# EAGLE design Telecoding-Shield (EAGLE 7.6.0)
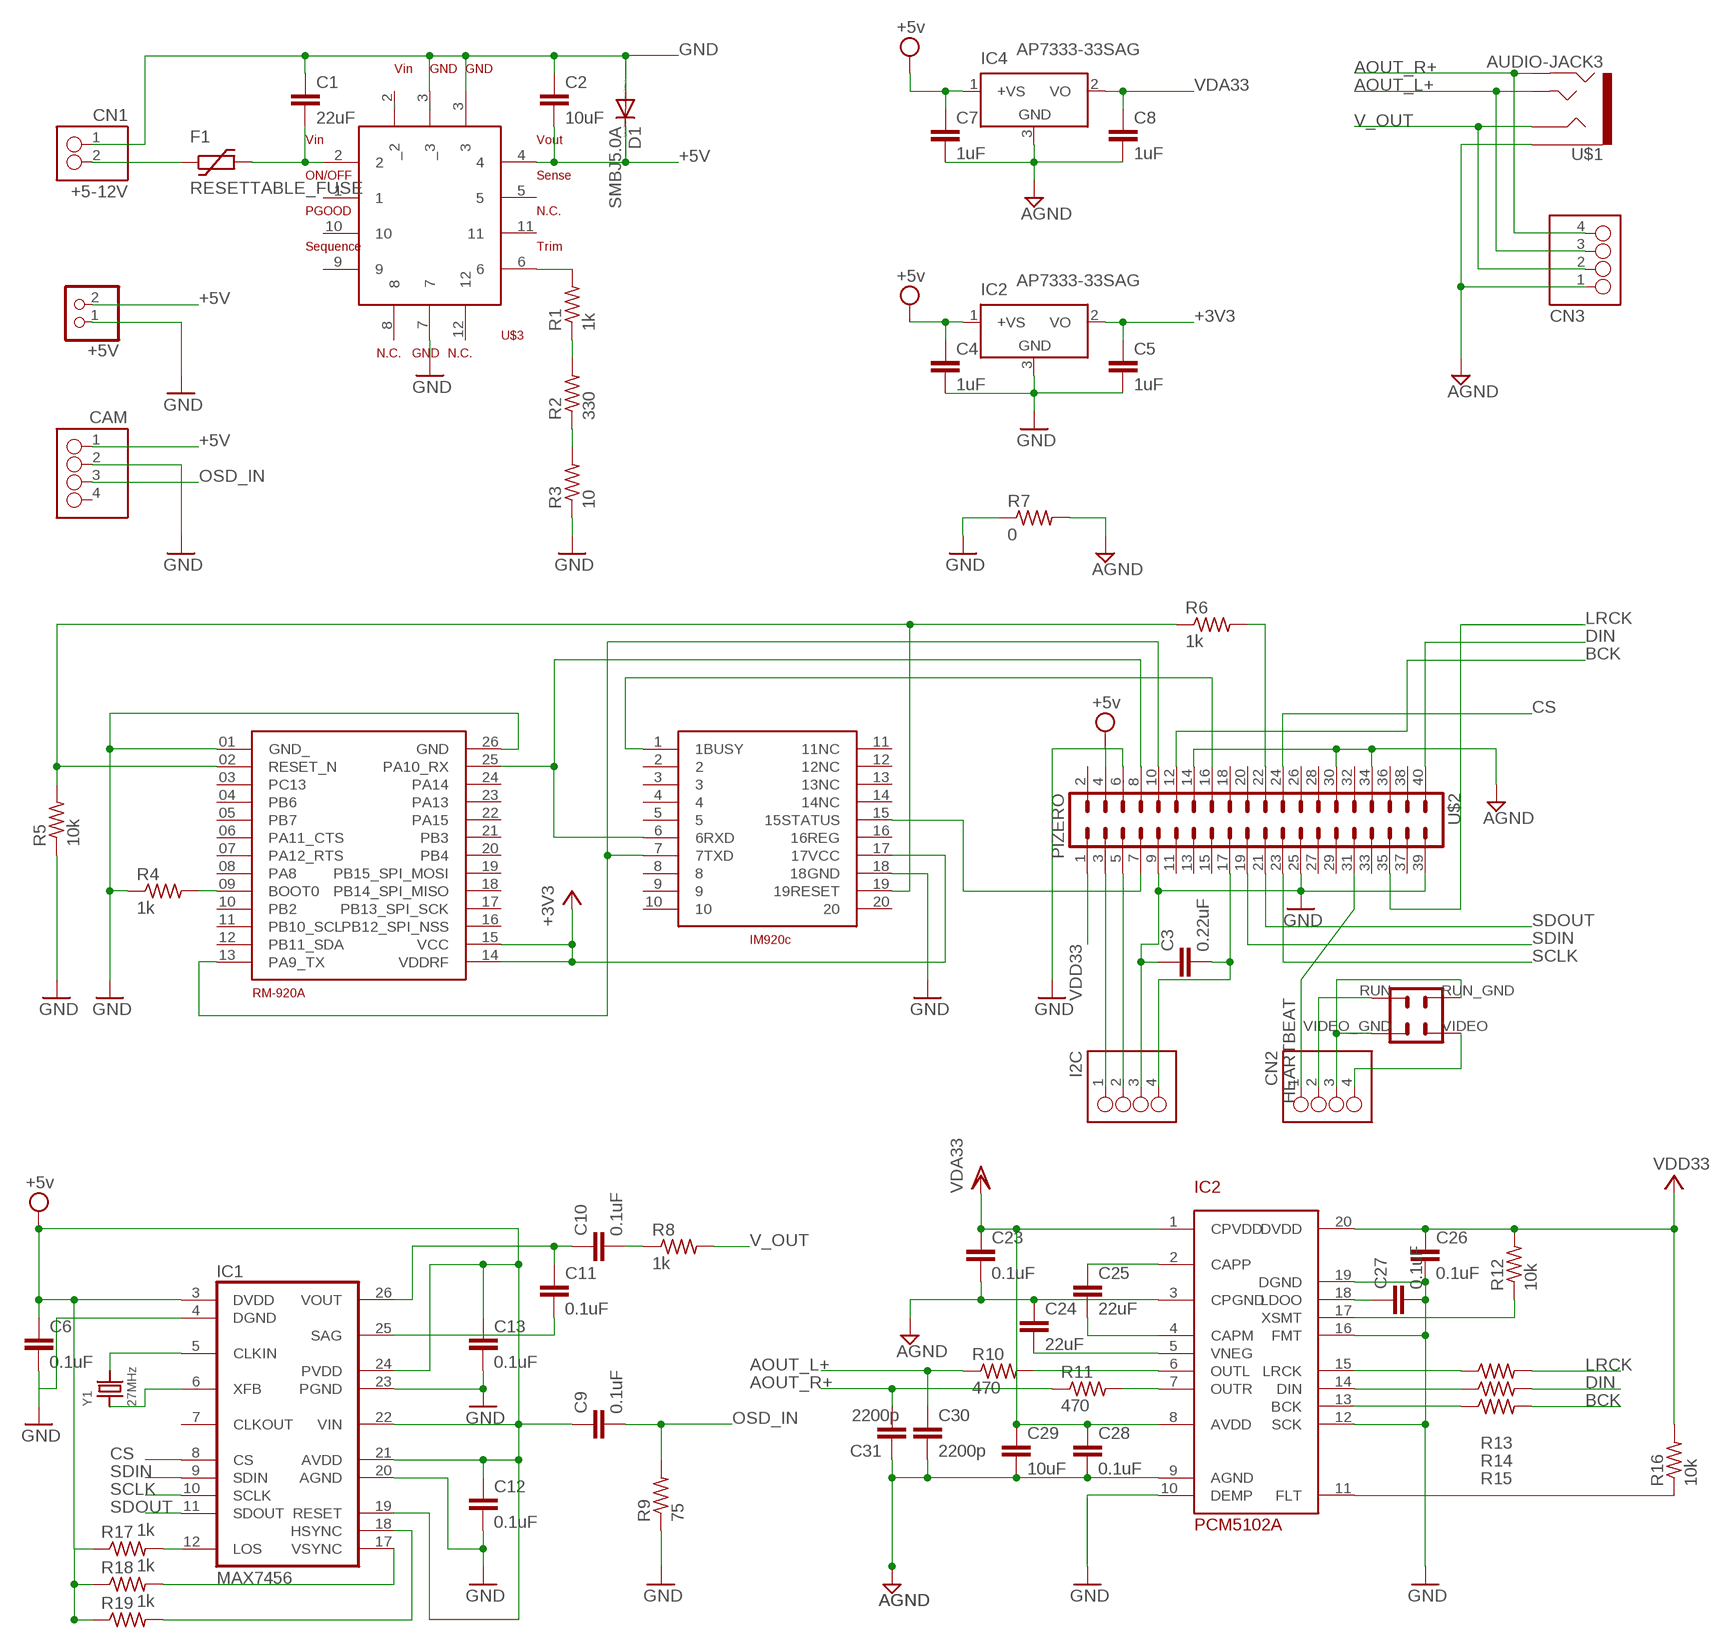
[diagram p0: schematic, sheet 1]

## Parts
+5V  PINHD-1X2  [1X02]
C1  22uF  10UF-0805-10V-10%  [0805]
C2  10uF  10UF-0805-10V-10%  [0805]
C3  0.22uF  10UF-0805-10V-10%  [0805]
C4  1uF  10UF-0805-10V-10%  [0805]
C5  1uF  10UF-0805-10V-10%  [0805]
C6  0.1uF  10UF-0805-10V-10%  [0805]
C7  1uF  10UF-0805-10V-10%  [0805]
C8  1uF  10UF-0805-10V-10%  [0805]
C9  0.1uF  10UF-0805-10V-10%  [0805]
C10  0.1uF  10UF-0805-10V-10%  [0805]
C11  0.1uF  10UF-0805-10V-10%  [0805]
C12  0.1uF  10UF-0805-10V-10%  [0805]
C13  0.1uF  10UF-0805-10V-10%  [0805]
C23  0.1uF  10UF-0805-10V-10%  [0805]
C24  22uF  10UF-0805-10V-10%  [0805]
C25  22uF  10UF-0805-10V-10%  [0805]
C26  0.1uF  10UF-0805-10V-10%  [0805]
C27  0.1uF  10UF-0805-10V-10%  [0805]
C28  0.1uF  10UF-0805-10V-10%  [0805]
C29  10uF  10UF-0805-10V-10%  [0805]
C30  2200p  10UF-0805-10V-10%  [0805]
C31  2200p  10UF-0805-10V-10%  [0805]
CAM  SM04B-SRSS-TB  [SM04B-SRSS-TB]
CN1  +5-12V  SM02B-SRSS-TB  [SM02B-SRSS-TB]
CN2  SM04B-SRSS-TB  [SM04B-SRSS-TB]
CN3  SM04B-SRSS-TB  [SM04B-SRSS-TB]
D1  SMBJ5.0A  S1M  [SMA]
F1  RESETTABLE_FUSE  1812L  [1812L]
I2C  SM04B-SRSS-TB  [SM04B-SRSS-TB]
IC1  MAX7456  [TSSOP28]
IC2  AP7333-33SAG  LM50  [SOT23]
IC3  PCM5102  [TSSOP20]
IC4  AP7333-33SAG  LM50  [SOT23]
R1  1k  R-US_M0805  [M0805]
R2  330  R-US_M0805  [M0805]
R3  10  R-US_M0805  [M0805]
R4  1k  R-US_M0805  [M0805]
R5  10k  R-US_M0805  [M0805]
R6  1k  R-US_M0805  [M0805]
R7  0  R-US_M0805  [M0805]
R8  1k  R-US_M0805  [M0805]
R9  75  R-US_M0805  [M0805]
R10  470  R-US_M0805  [M0805]
R11  470  R-US_M0805  [M0805]
R12  10k  R-US_M0805  [M0805]
R13  27  R-US_M0805  [M0805]
R14  27  R-US_M0805  [M0805]
R15  27  R-US_M0805  [M0805]
R16  10k  R-US_M0805  [M0805]
R17  1k  R-US_M0805  [M0805]
R18  1k  R-US_M0805  [M0805]
R19  1k  R-US_M0805  [M0805]
RM-920A  RM-92A_SOCKETBP  [RM-92A]
U$1  AUDIO-JACK3  [AUDIO-JACK-TRRS-SMD]
U$2  PIZERO  PIZERO_THROUGH_HOLE  [PIZERO_THOUGH_HOLE]
U$3  MURATA_OKL_T6_W12  [MURATA_OKL_T6_W12]
U$7  IM920C  [IM920C]
Y1  27MHz  CRYSTAL.ABS07  [ABS07]

## Nets
+3V3: C5.1 IC2.2(VO) RM-920A.14(VDDRF) RM-920A.15(VCC) U$7.17(17VCC)
+5V: +5V.2 C2.2 C4.1 C6.1 C7.1 C9.1 C12.1 C13.1 CAM.1 D1.C IC1.3(DVDD) IC1.19(RESET) IC1.21(AVDD) IC1.22(VIN) IC1.24(PVDD) IC2.1(+VS) IC4.1(+VS) R17.1 R18.1 R19.1 U$2.4 U$3.4 ; supply symbol labelled +5v
AGND: C7.2 C8.2 C23.2 C24.1 C28.2 C29.2 C30.2 C31.1 CN3.1 IC3.3(CPGND) IC3.9(AGND) IC4.3(GND) R7.2 U$1.EARTH U$2.14 U$2.30 U$2.34 U$3.7 ; supply symbol labelled GND
AOUT_L+: C30.1 CN3.3 R10.1 U$1.TIP
AOUT_R+: C31.2 CN3.4 R11.1 U$1.RING2
BCK: R15.2 U$2.12
CS: IC1.8(CS) U$2.24
DIN: R14.2 U$2.40
GND: +5V.1 C1.1 C2.1 C3.1 C4.2 C5.2 C6.2 C12.2 C13.2 C26.2 C27.2 CAM.2 CN1.1 CN2.3 D1.A I2C.3 IC1.4(DGND) IC1.20(AGND) IC1.23(PGND) IC2.3(GND) IC3.10(DEMP) IC3.12(SCK) IC3.16(FMT) IC3.19(DGND) R3.1 R4.1 R5.1 R7.1 R9.1 RM-920A.01(GND_) RM-920A.26(GND) U$2.6 U$2.9 U$2.25 U$2.39 U$2.RUN_GND U$2.VIDEO_GND(VIDEOP_GND) U$3.3 U$3._3 U$7.18(18GND)
HEARTBEAT: CN2.1 U$2.31
LRCK: R13.2 U$2.35
N$1: R5.2 R6.1 RM-920A.02(RESET_N) U$7.19(19RESET)
N$3: C1.2 F1.2 U$3.2
N$4: R6.2 U$2.22
N$5: RM-920A.25(PA10_RX) U$2.8 U$7.6(6RXD)
N$6: R4.2 RM-920A.09(BOOT0)
N$7: R2.1 R3.2
N$8: U$2.7 U$7.15(15STATUS)
N$9: U$2.16 U$7.1(1BUSY)
N$10: R1.1 R2.2
N$11: R1.2 U$3.6
N$12: CN2.4 U$2.VIDEO
N$13: IC1.5(CLKIN) Y1.2
N$14: RM-920A.13(PA9_TX) U$2.10 U$7.7(7TXD)
N$15: CN1.2 F1.1
N$16: IC1.6(XFB) Y1.1
N$17: IC1.12(LOS) R17.2
N$18: IC1.17(VSYNC) R18.2
N$19: IC1.18(HSYNC) R19.2
N$22: I2C.1 U$2.3
N$25: I2C.2 U$2.5
N$27: C3.2 I2C.4 U$2.17
N$29: CN2.2 U$2.RUN
N$33: C10.1 C11.1 IC1.26(VOUT)
N$34: C10.2 R8.1
N$35: C11.2 IC1.25(SAG)
N$41: C24.2 IC3.5(VNEG)
N$42: C25.1 IC3.2(CAPP)
N$43: C25.2 IC3.4(CAPM)
N$44: C27.1 IC3.18(LDOO)
N$45: IC3.7(OUTR) R11.2
N$46: IC3.15(LRCK) R13.1
N$47: IC3.6(OUTL) R10.2
N$49: IC3.14(DIN) R14.1
N$50: IC3.13(BCK) R15.1
N$51: IC3.11(FLT) R16.1
N$52: IC3.17(XSMT) R12.1
OSD_IN: C9.2 CAM.3 R9.2
SCLK: IC1.10(SCLK) U$2.23
SDIN: IC1.9(SDIN) U$2.19
SDOUT: IC1.11(SDOUT) U$2.21
V_OUT: CN3.2 R8.2 U$1.RING1
VDA33: C8.1 C23.1 C28.1 C29.1 IC3.1(CPVDD) IC3.8(AVDD) IC4.2(VO)
VDD33: C26.1 IC3.20(DVDD) R12.2 R16.2 U$2.1
Unconnected: CAM.4 IC1.7(CLKOUT) RM-920A.03(PC13) RM-920A.04(PB6) RM-920A.05(PB7) RM-920A.06(PA11_CTS) RM-920A.07(PA12_RTS) RM-920A.08(PA8) RM-920A.10(PB2) RM-920A.11(PB10_SCL) RM-920A.12(PB11_SDA) RM-920A.16(PB12_SPI_NSS) RM-920A.17(PB13_SPI_SCK) RM-920A.18(PB14_SPI_MISO) RM-920A.19(PB15_SPI_MOSI) RM-920A.20(PB4) RM-920A.21(PB3) RM-920A.22(PA15) RM-920A.23(PA13) RM-920A.24(PA14) U$2.2 U$2.11 U$2.13 U$2.15 U$2.18 U$2.20 U$2.26 U$2.27 U$2.28 U$2.29 U$2.32 U$2.33 U$2.36 U$2.37 U$2.38 U$3.1 U$3.5 U$3.8 U$3.9 U$3.10 U$3.11 U$3.12 U$3._2 U$7.2 U$7.3 U$7.4 U$7.5 U$7.8 U$7.9 U$7.10 U$7.11(11NC) U$7.12(12NC) U$7.13(13NC) U$7.14(14NC) U$7.16(16REG) U$7.20

## Library data of the parts
+5V = pinhead:PINHD-1X2: PIN HEADER
C1 C3-C13 C23-C28 C30 C31 = SparkFun-Capacitors:10UF: 10.0µF ceramic capacitors A capacitor is a passive two-terminal electrical component used to store electrical energy temporarily in an electric field.; PROD_ID: CAP-11330; VALUE: 10uF
C2 C29 = SparkFun-Capacitors:10UF: 10.0µF ceramic capacitors A capacitor is a passive two-terminal electrical component used to store electrical energy temporarily in an electric field.; PROD_ID: CAP-11330
CAM CN2 CN3 I2C = con-jst-sh:SM04B-SRSS-TB
CN1 = con-jst-sh:SM02B-SRSS-TB
D1 = diode:S1M
F1 = ptc-littlefuse:1812L: FUSE
IC1 = max7456:MAX7456
IC2 IC4 = linear:LM50: SOT-23 Single-Supply Centigrade Temperature Sensor Vout = (10mV/°C x Temp °C) +5mmmV Source: http://cache.national.com/ds/LM/LM50.pdf
IC3 = PCM5102:PCM5102
R1-R19 = resistor:R-US_: RESISTOR, American symbol
RM-920A = RM-92A:RM-92A_SOCKET: RM-92A Connector 13pin × 2 (1.27pitch)
U$1 = SparkFun-Connectors:AUDIO-JACK3: Audio jack - 3.5mm TRRS variety - two rings.; PROD_ID: CONN-10676
U$2 = pizero_video:PIZERO_THROUGH_HOLE: raspberry pi zero with RUN & VIDEO PIN
U$3 = murata-DCDC:MURATA_OKL_T6_W12: Murata DC-DC Converter OKL_T6_W12 OUTPUT:5V 3A
U$7 = IM920c:IM920C: interplan IM920c
Y1 = abracon:CRYSTAL

## Board
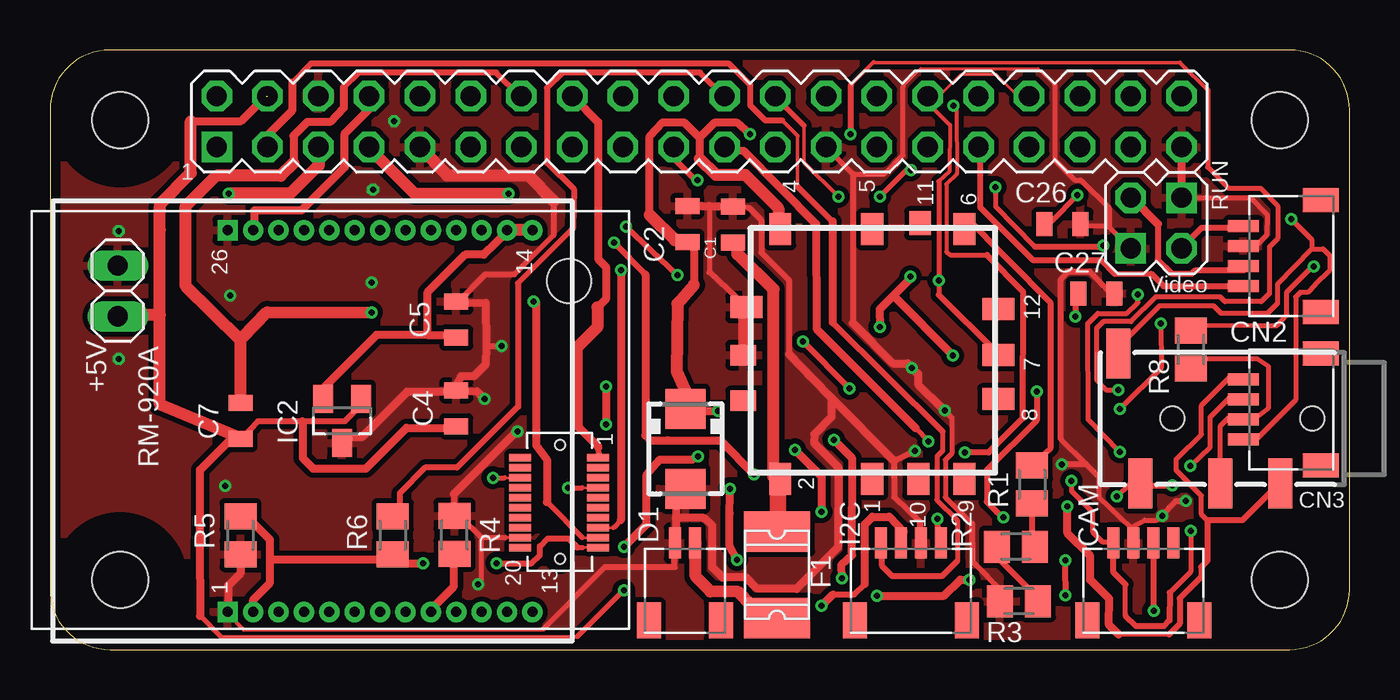
[diagram p1: board, top side]
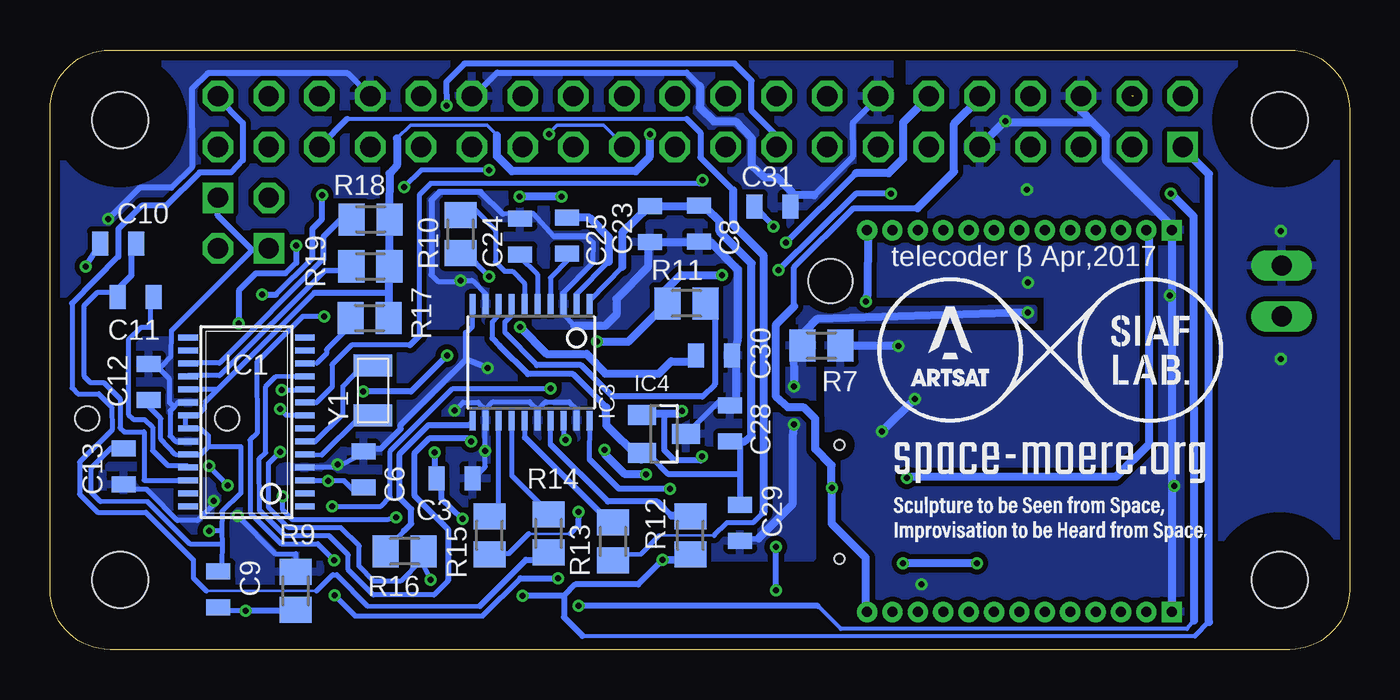
[diagram p2: board, bottom side, seen from below]

Size 65 x 30 mm. Coordinates in mm from the lower left corner, seen from the top.
Copper layers (1*16): Top 0.035mm / dielectric 1.53mm / Bottom 0.035mm
Design rules "pban_5mil-l2 *": minimum track width 5mil, minimum drill 0.3mm, track to track 5mil, track to pad 0.229mm, pad to pad 5mil, via to via 5mil, smd to smd 5mil, copper to edge 0.5mm, drill to drill 0.5mm, minimum pad ring 0.15mm, minimum via ring 0.15mm, stop-mask expansion 0.05mm, vias tented up to drill 0.35mm, thermal gap 10mil

### Footprints (pad centres in the part's own frame; a part is rotated, then mirrored left to right if it is on the bottom)
1X02 = drill 1.016 long: 1 -1.27,0; 2 1.27,0
0805 = smd 0.8 x 1.2: 1 -0.9,0; 2 0.9,0
SM04B-SRSS-TB = smd 0.6 x 1.55: 1 -1.5,3.04; 2 -0.5,3.04; 3 0.5,3.04; 4 1.5,3.04 | smd 1.2 x 1.8: P-MOUNT1 -2.8,-0.835; P-MOUNT2 2.8,-0.835
SM02B-SRSS-TB = smd 0.6 x 1.55: 1 -0.5,3.04; 2 0.5,3.04 | smd 1.2 x 1.8: P-MOUNT1 -1.8,-0.835; P-MOUNT2 1.8,-0.835
SMA = smd 2 x 2: A 2,0; C -2,0
1812L = smd 2.03 x 3.3: 1 -2.16,0; 2 2.16,0
TSSOP28 = smd 0.305 x 0.991: 1 -4.225,-2.918; 2 -3.575,-2.918; 3 -2.925,-2.918; 4 -2.275,-2.918; 5 -1.625,-2.918; 6 -0.975,-2.918; 7 -0.325,-2.918; 8 0.325,-2.918; 9 0.975,-2.918; 10 1.625,-2.918; 11 2.275,-2.918; 12 2.925,-2.918; 13 3.575,-2.918; 14 4.225,-2.918; 15 4.225,2.918; 16 3.575,2.918; 17 2.925,2.918; 18 2.275,2.918; 19 1.625,2.918; 20 0.975,2.918; 21 0.325,2.918; 22 -0.325,2.918; 23 -0.975,2.918; 24 -1.625,2.918; 25 -2.275,2.918; 26 -2.925,2.918; 27 -3.575,2.918; 28 -4.225,2.918
SOT23 = smd 1 x 1.4: 1 -0.95,-1.1; 2 0.95,-1.1; 3 0,1.1
TSSOP20 = smd 0.305 x 0.991: 1 -2.925,-2.918; 2 -2.275,-2.918; 3 -1.625,-2.918; 4 -0.975,-2.918; 5 -0.325,-2.918; 6 0.325,-2.918; 7 0.975,-2.918; 8 1.625,-2.918; 9 2.275,-2.918; 10 2.925,-2.918; 11 2.925,2.918; 12 2.275,2.918; 13 1.625,2.918; 14 0.975,2.918; 15 0.325,2.918; 16 -0.325,2.918; 17 -0.975,2.918; 18 -1.625,2.918; 19 -2.275,2.918; 20 -2.925,2.918
M0805 = smd 1.3 x 1.6: 1 -0.95,0; 2 0.95,0
RM-92A = drill 0.5 pad 1.016 square: 01 -9.55,8.89; 26 9.55,8.89 | drill 0.5 pad 1.016: 02 -9.55,7.62; 03 -9.55,6.35; 04 -9.55,5.08; 05 -9.55,3.81; 06 -9.55,2.54; 07 -9.55,1.27; 08 -9.55,0; 09 -9.55,-1.27; 10 -9.55,-2.54; 11 -9.55,-3.81; 12 -9.55,-5.08; 13 -9.55,-6.35; 14 9.55,-6.35; 15 9.55,-5.08; 16 9.55,-3.81; 17 9.55,-2.54; 18 9.55,-1.27; 19 9.55,0; 20 9.55,1.27; 21 9.55,2.54; 22 9.55,3.81; 23 9.55,5.08; 24 9.55,6.35; 25 9.55,7.62
AUDIO-JACK-TRRS-SMD = smd 1.2 x 2.5: EARTH 11.3,-3.25; RING1 6.2,3.25; RING2 3.2,3.25; TIP 10.2,3.25 | hole 1.2: 1.6,0; 8.6,0
PIZERO_THOUGH_HOLE = drill 1.016 square: 1 8.34,25.15; RUN_GND 56.6,22.61; VIDEO_GND 54.06,20.07 | drill 1.016 octagon: 2 8.34,27.69; 3 10.88,25.15; 4 10.88,27.69; 5 13.42,25.15; 6 13.42,27.69; 7 15.96,25.15; 8 15.96,27.69; 9 18.5,25.15; 10 18.5,27.69; 11 21.04,25.15; 12 21.04,27.69; 13 23.58,25.15; 14 23.58,27.69; 15 26.12,25.15; 16 26.12,27.69; 17 28.66,25.15; 18 28.66,27.69; 19 31.2,25.15; 20 31.2,27.69; 21 33.74,25.15; 22 33.74,27.69; 23 36.28,25.15; 24 36.28,27.69; 25 38.82,25.15; 26 38.82,27.69; 27 41.36,25.15; 28 41.36,27.69; 29 43.9,25.15; 30 43.9,27.69; 31 46.44,25.15; 32 46.44,27.69; 33 48.98,25.15; 34 48.98,27.69; 35 51.52,25.15; 36 51.52,27.69; 37 54.06,25.15; 38 54.06,27.69; 39 56.6,25.15; 40 56.6,27.69; RUN 54.06,22.61; VIDEO 56.6,20.07 | hole 2.8: 3.5,3.5; 3.5,26.5; 61.5,26.5; 61.5,3.5
MURATA_OKL_T6_W12 = smd 1.6 x 1.1: 1 -5.44,0.15; 2 -5.44,4.75; 4 7.06,4.75; 5 7.06,0.15; 6 7.06,-4.45; 9 -5.44,-4.45; 10 -5.44,-2.15 | smd 1.1 x 1.6: 3 3.16,6.45; 7 0.76,-6.15; 8 -1.44,-6.15; 12 3.06,-6.15 | smd 1.2 x 1.1: 11 7.36,-2.25 | smd 1.016 x 1.27: _2 -1.524,6.604; _3 0.762,6.604
IM920C = smd 0.36 x 1.1: 1 -1.825,-13.45; 2 -1.825,-9.55; 3 -2.325,-13.45; 4 -2.325,-9.55; 5 -2.825,-13.45; 6 -2.825,-9.55; 7 -3.325,-13.45; 8 -3.325,-9.55; 9 -3.825,-13.45; 10 -3.825,-9.55; 11 -4.325,-13.45; 12 -4.325,-9.55; 13 -4.825,-13.45; 14 -4.825,-9.55; 15 -5.325,-13.45; 16 -5.325,-9.55; 17 -5.825,-13.45; 18 -5.825,-9.55; 19 -6.325,-13.45; 20 -6.325,-9.55 | hole 2.2: 7,-12 | hole 0.5: -6.9,-11.55; -1.2,-11.55
ABS07 = smd 1.1 x 1.9: 1 -1.25,0; 2 1.25,0

### Placement (x,y rotation side)
+5V  3.39,17.94 270 top
C1  34.16,21.27 270 top
C2  31.88,21.29 270 top
C3  44.77,8.57 180 bottom
C4  20.32,12.06 90 top
C5  20.32,16.51 90 top
C6  49.32,9 90 bottom
C7  9.53,11.43 90 top
C8  32.53,21.32 270 bottom
C9  56.58,3.02 270 bottom
C10  61.59,20.32 180 bottom
C11  60.72,17.64 0 bottom
C12  60.06,13.39 90 bottom
C13  61.32,9.16 270 bottom
C23  34.98,21.28 270 bottom
C24  41.48,20.67 270 bottom
C25  39.14,20.7 270 bottom
C26  50.64,21.28 0 top
C27  52.34,17.8 0 top
C28  30.98,11.3 90 bottom
C29  30.48,6.35 270 bottom
C30  31.78,14.71 0 bottom
C31  28.86,22.17 180 bottom
CAM  54.7,2.29 0 top
CN1  31.75,2.29 0 top
CN2  62.74,19.68 90 top
CN3  62.74,12.02 90 top
D1  31.77,10.05 270 top
F1  36.36,3.74 90 top
I2C  43.05,2.29 0 top
IC1  55.17,11.38 90 bottom
IC2  14.61,11.44 180 top
IC3  40.94,14.37 180 bottom
IC4  34.29,10.79 270 bottom
R1  49.12,8.26 90 top
R2  48.32,5.15 0 top
R3  48.47,2.42 0 top
R4  20.23,5.74 270 top
R5  9.53,5.71 90 top
R6  17.14,5.71 90 top
R7  26.4,15.21 180 bottom
R8  57.07,15.02 270 top
R9  52.7,2.94 270 bottom
R10  44.47,20.79 90 bottom
R11  33.17,17.32 0 bottom
R12  32.97,5.71 270 bottom
R13  36.83,5.42 270 bottom
R14  40.05,5.8 270 bottom
R15  43.02,5.71 270 bottom
R16  47.27,4.92 0 bottom
R17  49.01,16.59 180 bottom
R18  48.96,21.52 180 bottom
R19  48.98,19.18 180 bottom
RM-920A  17.78,11.43 90 top
U$1  64.75,11.55 180 top
U$2  0,0 0 top
U$3  41.27,13.97 90 top
U$7  13.97,11.43 90 top
Y1  48.85,12.96 270 bottom

### Tracks (layer width: path | path; a pad name or v marks a point on that pad's centre or on a via)
+3V3  (via drill 0.3)
  Top 0.127: 26.62,5.6 27.44,5.6 U$7.17
  Top 0.254: 19.69,15.74 20.3,15.7 C5.1 | 22.85,20.9 RM-920A.15 22.9,21 | 13.69,13.1 13.7,12.6 IC2.2 | 24.85,7.38 26.62,5.6 | 24.1,21 RM-920A.14
  Top 0.406: 18.86,15.75 19.69,15.74 | 18.86,15.75 18.86,17.86 20.76,19.76 21.69,19.76 22.85,20.9 | 13.69,13.1 16.33,15.75 18.86,15.75 | v24.19,17.41 24.31,17.36 24.31,10.24 24.85,9.51 24.85,7.38
  Top 0.61: 24.1,21 22.9,21
  Bottom 0.127: 24.1,20.98 RM-920A.14
  Bottom 0.406: v24.19,17.41 24.21,17.49 24.11,17.76 24.1,20.98
+5V  (via drill 0.3)  (1 unrouted)
  Top 0.127: 32.09,20.3 C2.2 | 32.1,20.5 31.25,20.48 | 9,26.5 9.56,26.44 | 5.5,21 5.49,21
  Top 0.2: 8.53,0.65 26.38,0.66
  Top 0.254: v51.09,8.45 51.09,7.94 52.14,6.89 52.14,5.9 52.62,5.4 53.1,5.4 CAM.1 53.2,5.3 | 53.79,1.7 53.79,3.26 | 56,2.85 57.05,3.9 v57.05,5.95 | 15.5,12.5 15.53,12.5 15.6,12.6 IC2.1 | 9.6,10.6 C7.1 | 9.5,10.6 C7.1 | 32.42,9.66 v32.4,9.66 | v28.7,2.96 28.75,3.04 26.38,0.66 | 7.51,1.68 8.53,0.65 | 31.76,12.1 D1.C | 31.77,12.92 D1.C | 20.3,11.25 C4.1 20.3,11.1 | 32.51,25.64 32.49,25.6 | U$3.4 36.5,21.1 36.42,21.1 | 32.1,20.5 C2.2 | D1.C 31.8,12 31.9,11.93 | 9,10.5 C7.1
  Top 0.305: 53.2,5.3 53.2,3.85 53.79,3.26 | 53.79,1.7 54.33,1.18 55.71,1.18 55.99,1.46 56,2.85 | 15.53,12.5 15.22,12.2 15.22,11.91 14.75,11.44 12.63,11.44 10.4,11.44 9.6,10.6 | 32.12,9.51 32.42,9.66
  Top 0.406: 31.9,11.93 v33.4,11.93 | 7.04,26.44 9.56,26.44 10.8,27.68 | 32.12,9.51 30.5,9.51 29.84,8.75 29.84,6.26 v28.7,5.14 | 7.51,1.68 7.5,5.36 7.5,5.5 7.5,9 9,10.5 | 32.2,20.3 32.2,18.24 | 32.49,24.56 32.49,25.6 31.7,26.39 30.66,26.39 29.99,25.68 29.99,21.75 | 32.51,25.64 33.23,26.35 34.36,26.35 v35,25.8 | 20.3,11.1 17.83,11.1 15.8,9.06 13.16,9.06 12.64,9.58 12.63,11.44 | 3.5,16.75 +5V.2
  Top 0.61: 7.04,26.44 7.04,23.84 5.51,22.29 5.49,22.01 5.49,21 5.49,16.75 | 5.49,16.75 5.49,12.28 9.5,10.6 | 32.09,20.3 32.2,20.3 | 32.2,18.24 31.38,17.3 31.34,13.91 31.77,12.92 | 36.42,21.06 36.42,21.1 36.42,22.09 34.76,23.76 33.3,23.76 32.49,24.56 | 31.25,20.48 29.99,21.75 | 5.49,16.75 3.5,16.75
  Bottom 0.127: 57.09,10.16 57.08,10.15 | 61.92,10.11 61.4,10.14 | 61.4,10.14 61.2,10.15 | 35.3,11.8 IC4.1 | 48.02,21.59 R18.1 48.04,21.91 | 48.02,18.89 R19.1 48.1,18.86 | 58.2,11.7 IC1.21 58.01,11.8 58.09,11.69 | 58.2,11.2 IC1.22 58,11.1 57.8,11.1 57.75,11.06 | IC1.19 | IC1.3 52.3,8.5 52.3,8.45 | 58,9.72 58,9.7 IC1.24 | C9.1 56.39,3.92 56.43,4.09 56.41,4.3 | C12.1 60.1,12.4 60.2,12.4 60.25,12.35 | C13.1 61.4,10.1 61.4,10.14
  Bottom 0.18: 47.64,25.59 46.98,26.24 43.15,26.24 42.65,25.74
  Bottom 0.2: 57.59,11.71 57.25,12.04 57.22,12.41
  Bottom 0.254: 52.3,8.45 v51.09,8.45 50.29,8.45 49.88,8.03 | 49.85,8 49.88,8.03 | 58.2,9.72 58,9.72 57.51,9.72 57.08,10.15 | 58.2,9.72 58.29,9.72 | 57.75,11.06 57.45,11.06 57.09,10.71 57.09,10.16 55.46,10.15 55.46,7.83 56.4,6.91 56.41,5.95 | 56.41,5.95 56.4,5.28 | 56.4,5.28 56.41,4.3 56.39,4.3 | 61.92,10.11 62.94,9.1 62.94,7.88 62.48,7.41 60.11,7.4 57.99,5.28 56.4,5.28 | 60.38,12.47 60.25,12.35 59.46,11.56 59.45,10.54 58.7,9.75 58.2,9.72 | 56.41,5.95 v57.05,5.95 | v33.4,11.93 33.5,11.8 | v32.4,9.66 32.45,9.46 | 58.2,11.2 58.2,11.7 | 56.62,13.01 IC1.19 | 58.09,11.69 57.59,11.71 | 57.22,12.41 56.62,13.01 | 56.62,13.01 51.77,17.86 | C6.1 49.4,8.1 49.8,8.1 49.88,8.03
  Bottom 0.305: 34.27,11.8 34.27,9.97 33.77,9.46 32.45,9.46 | v28.7,2.96 v28.7,5.14 | 51.77,17.86 48.06,17.86
  Bottom 0.406: 33.5,11.8 34.27,11.8 35.3,11.8 | 48.02,18.89 48.02,21.59 | 48.1,18.86 48.06,17.86 R17.1 | 48.04,21.91 48.02,23.82 47.64,24.23 47.64,25.59 | 42.65,25.74 42.65,24.69 41.9,23.94 35.71,23.94 35,24.66 v35,25.8
AGND  (via drill 0.3)
  Top 0.127: 44,27.68 U$2.30 44.01,27.23
  Top 0.16: 48.4,27.7 47.32,28.78 45.56,28.78 44.01,27.23
  Top 0.2: 44.45,23.43 44.98,23.91 45.02,26.25 44.01,27.23
  Top 0.254: 9.5,12.4 C7.2 | 23.5,27.7 U$2.14 | 63.1,20.04 63.67,20.04 64,19.72 64,18.98 63.26,18.23 62.9,17.88 62.73,17.87 62.52,17.87 62.3,17.65 62.3,12.5 60.3,10.5 59.7,10.6 CN3.1 | 63.1,20.04 61.4,18.29 61.4,17.33 60.91,16.84 58.56,16.84 58.19,17.21 55.5,17.21 53.73,15.44 53.5,14.9 U$1.EARTH | 44.45,23.43 v44.45,18.48 44.45,17.75 | 44,27.68 44.01,27.23 | 47.4,14.8 U$3.7 | 48.4,27.7 48.9,27.7 U$2.34 | 63.1,20.04 63.1,20.52 v62.08,21.54 | 9.6,15.6 9.5,15.53
  Top 0.305: 14.69,28.14 15.45,28.88 22.31,28.88 23.5,27.7 | 47.4,14.8 47.29,14.94 44.45,17.75
  Top 0.406: 12.18,24.34 12.18,25.71 12.86,26.4 14,26.4 14.69,27.1 14.69,28.14 | v27.8,13.16 v27.8,11.26
  Top 0.61: 9.5,12.4 9.5,15.53 6.76,18.23 6.76,22.16 8.31,23.71 11.55,23.71 12.18,24.34 | v16.08,16.87 10.87,16.88 9.6,15.6
  Bottom 0.127: C31.1 27.79,22.74 27.9,22.9 | 27.82,15.16 R7.2 27.81,15.32 | 43.2,17.8 43.23,17.3 IC3.9 | 30.8,14.7 30.69,14.4 | 39.3,16.8 39.3,17.2 IC3.3 39.38,17.81 | 35,20.4 C23.2 | 30.8,14.8 C30.2 | 31.98,20.39 C8.2 | 43.9,27.6 U$2.30
  Bottom 0.254: 23.6,27.6 U$2.14 | 27.79,7.66 27.86,7.25 | 29.56,5.56 30.43,5.54 C29.2 | 43.2,17.8 43.85,18.45 43.91,18.48 v44.45,18.48 44.34,18.43 45.6,18.43 45.92,18.75 | 42.35,21.8 41.73,21.81 C24.1 41.06,21.82 40.83,21.82 39.79,20.68 | 30.69,12.3 C28.2 30.69,12.43 31.51,12.45 32.83,11.15 IC4.3 33.1,10.7 33.06,10.5 | 30.8,14.7 C30.2 | 38.77,16.2 39.3,16.8 | 35.1,20.3 C23.2 | 32,20.4 C8.2 | 38.19,20.68 37.83,20.38 37.83,19.36 39.38,17.81 | 30.56,5.26 30.55,5.54 | 49,27.7 U$2.34
  Bottom 0.305: 26.77,22.74 24.85,24.68 24.86,26.34 23.6,27.6 | 45.92,18.75 45.92,22.49 45.51,22.9 43.45,22.9 42.35,21.8 | 38.19,20.68 39.79,20.68 | 30.55,5.54 29.56,5.56 | v62.08,21.54 60.51,23.1 58.94,23.1 57.9,24.14 57.9,28.06 57.12,28.84 50.12,28.84 49,27.7 | 32.5,28.2 33.16,28.86 42.63,28.86 43.9,27.6
  Bottom 0.406: 26.77,22.74 27.79,22.74 | 29.56,5.56 27.86,7.25 27.85,10.69 v27.8,11.26 | 30.69,14.4 30.69,12.43 30.69,12.3 | 38.77,16.2 37.24,16.2 36.67,16.76 36.67,17.55 35.1,19.14 35.1,20.3 | 35,20.4 32,20.4 | 30.8,14.8 30.61,15.5 30.61,19.02 31.98,20.39 | 27.81,15.32 26.65,16.54 v16.08,16.87 | 27.9,22.9 28.64,23.64 29.26,23.64 29.91,24.25 29.91,25.59 30.73,26.43 31.8,26.43 32.5,27.11 32.5,28.2 | 27.82,15.16 27.8,15.16 27.81,15.32 | 27.81,15.32 v27.8,13.16
  pour Bottom (isolate 0.254): 65.02,30.13 23.01,30.08 23,26.48 24.86,26.48 24.88,16.99 15.83,17.08 15.83,16.5 26.88,16.5 26.88,4.6 36.2,4.6 36.2,16.19 65.1,16.19 65.1,30.05
AOUT_L+  (via drill 0.3)
  Top 0.127: 54.52,8.21 U$1.TIP 54.5,8.3
  Top 0.254: v57.04,9.2 58.02,10.14 58.02,11.64 59.09,12.69 59.66,12.56 CN3.3 | 54.5,8.3 54,8.3 v53.36,7.66
  Top 0.305: 54.52,8.21 v56.12,8.21 | v47.69,6.61 47.54,6.72 47.35,6.89 46.85,7.4 46.85,8.98 49.35,11.47 v49.35,12.91
  Top 0.406: v41.5,16.14 41.49,17.02 42.19,17.71 | v43.04,18.66 42.99,18.62 43.09,18.62 42.19,17.71 | 42.19,17.71 v45.15,14.7
  Bottom 0.127: 44.33,20 R10.1
  Bottom 0.254: v56.12,8.21 v57.04,9.2 | 44.33,20 v43.04,18.66 43.02,18.68 | 32.66,14.43 C30.1 | v53.36,7.66 53.36,6.98 52.88,6.5 48.12,6.5 v47.69,6.61
  Bottom 0.305: v49.35,12.91 46.94,12.91 v45.15,14.7
  Bottom 0.406: 32.66,14.43 33.94,14.43 34.55,13.8 37.23,13.81 38.16,14.8 40.16,14.8 v41.5,16.14
AOUT_R+  (via drill 0.3)
  Top 0.254: 57.88,6.47 57.59,6.78 57.59,7.7 56.33,8.97 56.33,9.53 57.59,10.78 57.59,12.21 58.99,13.62 59.6,13.62 CN3.4 | 61.47,8.3 U$1.RING2 | 55.98,0.76 53.44,0.76
  Top 0.305: 61.47,8.3 59.64,6.47 57.88,6.47 57.89,4.45 57.58,4.14 57.58,3.64 56.5,2.56 56.5,1.29 55.98,0.76 | v39.98,13.06 v37.65,15.41 | v31.39,18.75 v28.81,21.16
  Top 0.406: v50.89,7.17 50.89,5.82 52.02,4.69 52.02,3.49 52.98,2.55 52.96,1.24 53.44,0.76
  Bottom 0.127: 29.7,22.1 C31.2
  Bottom 0.254: v39.98,13.06 44.85,13.06 47.99,9.94 47.99,7.64 48.44,7.17 v50.89,7.17 | 34.2,17.3 R11.1 34.49,17.71
  Bottom 0.305: v28.81,21.16 29.7,22.1
  Bottom 0.406: 34.2,17.3 36.08,15.41 v37.65,15.41 | v31.39,18.75 33.46,18.75 34.49,17.71
BCK  (via drill 0.3)
  Top 0.305: v28.2,20.35 29.77,18.77
  Top 0.406: v38.58,6.89 38.58,8.68 v37.26,10 | v35.2,8.78 33.54,10.47 30.89,10.47 30.01,10.46 29.77,10.71 29.77,18.77
  Bottom 0.127: 39,5.8 41.06,5.8 | 28.29,20.38 v28.2,20.35 | 43.1,4.8 R15.2
  Bottom 0.254: 43.1,4.8 42.06,4.8 41.06,5.8 | 38.59,6.21 39,5.8 | 37.23,9.75 v37.26,10 | 21.1,27.6 U$2.12
  Bottom 0.305: v38.58,6.89 38.59,6.21 | 24.7,23.84 v28.2,20.35
  Bottom 0.406: 37.23,9.75 36.24,8.78 v35.2,8.78 | 24.7,23.84 23.06,23.84 22.34,24.56 22.34,26.36 21.1,27.6
CS  (via drill 0.3)
  Top 0.18: 37.71,26.21 37.71,24.38
  Top 0.2: 37.71,24.38 v39.42,22.66
  Top 0.254: v53.5,12.05 55.58,14.1 v55.56,16.31 | 52.62,20.16 v52.69,20.21 | 49.24,20.16 47.29,22.16 v47.29,23.14 | v43.05,24 42.83,24 v41.51,22.66 | 37.71,26.21 36.3,27.6 U$2.24
  Top 0.305: 49.24,20.16 52.62,20.16
  Bottom 0.127: 47.28,23.14 v47.29,23.14 | 52.4,11.74 IC1.8
  Bottom 0.254: 52.4,11.74 53.21,11.74 v53.5,12.05 | 52.69,19.36 53.24,18.82 | 47.28,23.14 46.42,24 v43.05,24
  Bottom 0.305: v55.56,16.31 55.56,17.96 54.7,18.82 53.24,18.82 | v52.69,20.21 52.69,19.36
  Bottom 0.406: v39.42,22.66 v41.51,22.66
DIN
  Bottom 0.127: 57.19,2.94 51.67,2.94 | 56.6,27.6 U$2.40
  Bottom 0.254: 43.5,2.19 49.11,2.17 50.66,3.75 50.86,3.74 51.67,2.94 | 57.19,2.94 57.84,3.59 57.84,4.5 60.2,6.88 62.62,6.88 63.52,7.78 63.52,9.39 61.9,10.99 61.91,12.13 62.56,12.8 63.6,12.8 63.9,13.08 63.9,17.32 | 39.91,4.5 R14.2
  Bottom 0.305: 39.91,4.5 41.19,4.5 43.5,2.19 | 63.9,17.32 61.59,19.65 61.59,21.04 60.41,22.21 59.18,22.21 57.52,23.88 55.95,23.88 55.35,24.48 55.35,26.35 56.6,27.6
GND  (via drill 0.3, 0.3 pad 0.25)
  Top 0.127: 22.76,5.61 U$7.18 | 54.06,5.81 54.05,6.09 CAM.2 54.2,5.61 54.06,5.81
  Top 0.16: 50.25,28.24 49.42,29.07 43.54,29.07 42.66,28.19
  Top 0.2: 24.65,1.02 9.7,1 8.9,1.8
  Top 0.254: 22.76,5.61 21.56,5.61 21.56,3.41 v21.41,3.26 | 20.56,6.6 R4.1 20.2,6.6 | 20.15,12.99 20.4,12.81 C4.2 | 20.4,17.4 C5.2 | 20.4,12.9 C4.2 | 14.7,10.59 IC2.3 | 20.3,12.9 C4.2 | 25.18,20.73 23.21,18.77 | 18.5,25.1 U$2.9 | 53,17.9 53.4,17.9 C27.2 | 50.56,10.53 51.83,9.28 52.49,8.62 52.49,7.59 54.05,6.09 54.75,6.47 55.34,6.47 55.58,6.7 v55.62,6.7 | 34.7,17 34.8,17.1 U$3.3 34.8,17.2 34.33,17.62 | 34.7,14.8 U$3._3 | CN2.3 59.7,20.09 60.21,20.09 60.87,20.74 60.88,21.75 60.02,22.6 U$2.RUN_GND | 52.9,21.2 52.98,21.2 52.98,22.08 51.55,23.5 51.25,23.5 50.25,24.49 50.25,28.24 | 52.9,21.2 51.6,21.2 C26.2 | 52.9,21.2 54,20.1 U$2.VIDEO_GND | 46.12,4.41 47.62,2.9 47.5,2.5 R3.1 | 46.12,6.29 44.77,7.62 44.77,9.5 45.1,9.81 45.11,11.6 44.94,11.76 v44.76,11.96 | U$2.25 38.9,25.1 38.96,24.99 40.16,23.8 41.73,23.8 42.66,24.73 42.66,28.19 | 31.3,7.6 31.7,8 D1.A | 31.3,5.4 CN1.1 | 34.4,22.2 C1.1 34.95,22.1 | 32.6,22.2 C2.1 | 43.5,5.4 I2C.3 | 32.98,22.2 32.98,18.89 | 24.65,1.02 27.76,4.13 | 8.9,1.8 RM-920A.01
  Top 0.305: 20.56,6.6 21.56,5.61 | 20.4,17.4 20.39,17.38 21.77,18.77 23.21,18.77 | 21.81,15.2 v22.57,15.2 | 20.2,7.79 20.2,6.6 | 25.19,22.45 25.18,20.73 | v56.81,7.44 56.32,7.44 55.58,6.7 | 53,17.9 52,18.93 50.9,18.93 50.56,18.54 50.56,10.53 | 51.83,9.28 v50.61,9.26 | 46.12,6.29 46.12,4.41 | 44.6,12.09 44.94,11.76 | 40.16,23.8 40.15,16.33 | 43.5,5.4 43.5,6.4 42.23,7.62 42.21,9.44 v43.25,9.95 | 36.96,14.78 36.95,18.5 35.58,19.88 35.58,21.48 34.95,22.1 | 32.98,18.89 34.33,17.62 | 27.76,4.13 31.25,4.13 CN1.1
  Top 0.406: 20.15,12.99 20.55,13.68 21.19,13.68 21.79,14.28 21.81,15.2 21.79,17.35 20.39,17.38 | v21.75,12.55 21.34,12.94 20.4,12.9 | 14.7,10.59 15.59,10.62 17.86,12.9 20.3,12.9 | U$2.RUN_GND U$2.39 | 40.15,16.33 42.15,14.32 42.89,14.32 v43.11,14.1 43.41,13.8 43.41,13.28 44.6,12.09 | v23.38,10.91 23.38,10.96 20.2,7.79 | 31.3,7.6 31.3,6.59 | 31.3,6.59 31.3,5.4 | 32.6,22.2 32.98,22.2 34.4,22.2 | 39.09,12.6 38.1,13.6 36.96,14.78 | 39.09,12.6 42.21,9.44 | 31.3,6.59 32.7,6.59 33.12,6.2 33.12,4.11 33.62,3.61 34.81,3.61 35.36,3.05 37.34,3.04 39.41,5.12 39.42,9.12 38.21,10.34 38.23,10.78 39.09,11.65 39.09,12.6 | R5.1 9.53,3.83 8.9,3.19 RM-920A.01
  Top 0.61: 25.19,22.45 23.91,23.74 19.86,23.74 18.5,25.1 | 34.7,17 34.7,14.8
  Bottom 0.127: 25.4,15.2 R7.1 | 18.5,25.2 U$2.9 | 8.9,1.92 RM-920A.01 | 8.9,20.9 RM-920A.26 8.82,21.11 | 51.69,9.12 IC1.4 | 43.86,17.2 IC3.10 | v56.81,7.44 56.81,7.26 | 61.31,8.03 C13.2 | v50.61,9.26 50.69,9.12 | 38.65,12.01 38.7,11.5 IC3.19 | 43.24,11.4 IC3.12 | IC3.12 43.2,11.5 43.23,12.01 IC3.12 | 39.09,12.39 39.03,12.39 | 58.2,10.43 IC1.23 | 58.2,12.38 IC1.20 | 59.54,14.06 60.1,14.16 C12.2 59.92,14.18 59.85,14.18 | 58.92,15.97 58.94,15.91 | 40.61,11.71 40.6,12 IC3.16 40.61,11.71
  Bottom 0.254: 51.69,9.12 50.69,9.12 49.45,9.74 48.9,9.7 C6.2 49.29,10.07 | 43.86,17.2 43.88,16.16 44.19,15.85 | 56.81,7.26 57.62,6.46 58.63,6.46 59.99,7.85 60.17,8.03 61.31,8.03 | v55.62,6.7 53.74,4.8 52.71,4.8 R9.1 | 38.65,12.01 39.03,12.39 40.21,12.4 40.6,12 41.01,12.4 42.84,12.4 43.23,12.01 43.58,12.38 44.35,12.38 v44.76,11.96 | 43.24,9.9 43.23,9.15 43.8,8.6 C3.1 | 43.24,9.9 43.24,11.4 | 58.2,10.43 58.74,10.43 59,10.69 59,11.95 58.8,12.15 | 58.8,12.15 58.6,12.38 58.2,12.38 | 59.54,14.06 59.01,13.54 59.01,12.36 58.8,12.15 | 54.9,20 58.92,15.97 | 58.94,15.91 58.95,14.67 59.44,14.18 59.85,14.18 | 54.1,20 U$2.VIDEO_GND | 43.24,9.9 v43.25,9.95
  Bottom 0.305: 44.18,14.52 44.19,15.85 | 44.18,14.52 47.46,11.24 47.46,11.04 48.44,10.06 49.29,10.07 | 54.1,20 54.9,20 56.6,21.72 U$2.RUN_GND | v43.11,14.1 44.18,14.52
  Bottom 0.406: v22.57,15.2 25.4,15.2 | 18.5,25.2 17.3,26.39 12.86,26.39 12.86,26.4 | 8.9,20.9 8.9,1.92 | 12.86,26.4 12.19,25.7 12.19,24.48 8.82,21.11 | v21.75,12.55 v23.38,10.91 | U$2.6 13.42,26.96 12.86,26.4
  other vias: 9,17.71 8.77,8.19 16.08,18.36 3.44,14.54 3.44,20.94 16.15,23.01 17.21,26.45
  pour Bottom (isolate 0.254): 65.25,-0.23 65.18,-0.23 65.18,15.49 36.89,15.49 36.9,3.58 26.08,3.57 26.07,15.8 15.09,15.8 15.09,17.78 24.14,17.8 24.14,25.71 22,25.69 22,30.21 -0.19,30.21 -0.19,-0.31 65.25,-0.31
  pour Top (isolate 0.254): -0.19,30.21 -0.16,30.21 -0.16,-0.39 65.18,-0.39 65.18,30.25
HEARTBEAT
  Top 0.127: 46.51,25.04 U$2.31
  Top 0.254: 59.6,18.18 CN2.1
  Top 0.305: 59.6,18.18 55.7,18.19 55.08,18.8 53.25,18.8 52.58,19.49 49.15,19.5 46.52,22.15 46.51,25.04
LRCK
  Bottom 0.127: 31.79,5.71 34.53,5.71 | 36.8,4.75 R13.2 | 51.5,25.2 U$2.35
  Bottom 0.2: 50.13,26.56 33.16,26.56
  Bottom 0.254: 36.8,4.75 35.46,4.78 34.53,5.71 | 31.79,5.71 31.14,6.35 29.84,6.35 29.32,6.88
  Bottom 0.305: 30.84,22.98 32.48,24.62 32.48,25.88 33.16,26.56 | 51.5,25.2 50.13,26.56
  Bottom 0.406: 29.32,6.88 29.32,19.75 30.84,21.26 30.84,22.98
N$1  (via drill 0.3)
  Top 0.127: 26.64,5.11 U$7.19
  Top 0.254: 26.38,5.11 26.64,5.11 | 17.45,4.33 17.2,4.7 R6.1 17,4.5 | 10,6.5 R5.2 | 10.17,2 RM-920A.02
  Top 0.305: 26.38,5.11 25.92,5.56 24.89,5.56 24.5,5.17 24.5,4.72 24.09,4.33 v22.34,4.33
  Top 0.406: 17.45,4.33 v18.65,4.33 | 10,6.5 11,5.5 11,4.5 | 11,4.5 11,3.34 10.17,2.5 10.17,2 | 17,4.5 11,4.5
  Bottom 0.406: v18.65,4.33 v22.34,4.33
N$3
  Top 0.254: 36.4,8.4 36.5,8.5 U$3.2 36.17,8.65 | 36.4,6 F1.2 | 34.39,20.22 C1.2
  Top 0.61: 34.39,20.22 34.38,19.79 36.19,18.02 36.17,8.65
  Top 0.813: 36.4,8.4 36.4,6
N$4
  Top 0.254: 17.48,6.7 17.2,6.7 R6.2 | 26.16,21.09 23.41,18.33 | 33.7,27.7 U$2.22
  Top 0.305: 17.48,6.7 17.49,7.83 18.77,9.11 20.36,9.11 23.41,12.16 23.41,18.33 | 26.16,21.09 26.2,23.04 24.85,24.35 24.85,28.1 25.62,28.88 32.51,28.88 33.7,27.7
N$5  (via drill 0.3)
  Top 0.127: 22.74,8.6 23.5,8.6 U$7.6
  Top 0.254: v22.15,8.6 22.74,8.6 | 10.22,20.98 RM-920A.25
  Top 0.406: 15.97,27.68 15.98,27.06 14.74,25.82 14.74,24.14 12.59,21.99 10.22,21.99 10.22,20.98
  Top 0.61: 15.97,27.68 U$2.8
  Bottom 0.127: 10.05,20.81 RM-920A.25
  Bottom 0.406: 10.05,20.81 10.05,10.27 11.68,8.64 22.1,8.65 v22.15,8.6
N$6
  Top 0.254: 20.2,4.7 R4.2 | 19.1,2.06 RM-920A.09
  Top 0.406: 20.2,4.7 20.2,3.17 19.1,2.06
N$7
  Top 0.254: 47.4,4.6 47.3,5.1 R2.1 | 49.5,2.5 R3.2
  Top 0.305: 49.5,2.5 47.4,4.6
N$8  (via drill 0.3)
  Top 0.127: 28.18,6.1 27.5,6.1 U$7.15
  Top 0.254: 28.55,6.49 28.18,6.1 | 15.99,25.07 U$2.7
  Top 0.406: v28.56,19 28.55,6.49
  Top 0.61: v22.94,22.81 18.23,22.82 15.99,25.07
  Bottom 0.305: v28.56,19 24.7,22.81 v22.94,22.81
N$9
  Top 0.127: 27.43,9.71 27.5,9.71 27.5,9.6 U$7.1
  Top 0.254: 26.2,27.6 U$2.16
  Top 0.305: 27.41,10.11 27.43,9.71
  Top 0.406: 27.38,17.12 27.8,17.54 27.8,19.15 27.41,19.55 27.41,26.39 26.2,27.6 | 26.34,11.25 27.41,10.18 27.41,10.11
  Top 0.61: 27.38,17.12 27.38,16.14 26.34,15.1 26.34,11.25
N$10
  Top 0.254: 49.1,5.2 R2.2 | 49.11,7.22 R1.1
  Top 0.305: 49.1,5.2 49.1,7.2 49.11,7.22
N$11
  Top 0.254: 45.75,21.69 45.8,21 U$3.6
  Top 0.305: 45.75,21.69 50.05,17.34 50.05,10.1 R1.2
N$12
  Top 0.127: 56.6,20.1 U$2.VIDEO
  Top 0.254: 59.6,21.1 CN2.4
  Top 0.305: 59.6,21.1 57.6,21.1 56.6,20.1
N$13
  Bottom 0.127: 52.15,9.72 IC1.5
  Bottom 0.254: 52.15,9.72 51.41,9.74 49.58,11.54 Y1.2
N$14  (via drill 0.3)
  Top 0.127: 26.62,8.1 27.4,8.1 U$7.7
  Top 0.254: v25.9,8.1 26.62,8.1
  Bottom 0.254: 24.2,1.9 RM-920A.13
  Bottom 0.305: 18.5,27.59 U$2.10 | 21.61,22.09 24.81,22.09 27.79,19.14 27.79,17.18 | v25.9,8.1 25.91,8.11
  Bottom 0.406: v25.9,8.1 25.9,6.29 24.2,4.59 24.2,1.9 | 18.5,27.59 19.79,26.3 19.79,23.93 21.61,22.09 | 25.91,8.11 25.91,9.22 26.73,10.04 26.73,11.55 27.29,12.11 28.1,12.12 28.69,12.65 28.69,16.27 27.79,17.18
N$15
  Top 0.254: 32.29,5.34 32.3,5.3 CN1.2 | 36.3,1.6 F1.1
  Top 0.61: 35.69,1.59 34.42,2.89 33.02,2.91 32.29,3.67 32.29,5.34
  Top 0.813: 36.3,1.6 35.69,1.59
N$16
  Bottom 0.127: 51.78,10.37 52.3,10.39 IC1.6
  Bottom 0.254: 51.78,10.37 50.36,11.76 50.36,13.18 49.33,14.24 Y1.1
N$17
  Bottom 0.127: 51.65,14.34 52.3,14.32 IC1.12
  Bottom 0.254: 51.65,14.34 51.17,14.81 51.17,15.01 50.3,15.9 R17.2
N$18
  Bottom 0.127: 58.14,14.35 IC1.17
  Bottom 0.254: 58.14,14.35 56.52,14.34 51.33,19.53 | 50.3,21.7 R18.2
  Bottom 0.305: 51.33,19.53 51.34,20.64 50.3,21.7
N$19
  Bottom 0.127: 58.1,13.71 IC1.18 | 50.39,18.95 R19.2
  Bottom 0.254: 58.1,13.71 56.52,13.71 51.27,18.95
  Bottom 0.305: 50.39,18.95 51.27,18.95
N$22
  Top 0.18: 37.39,25.71 37.39,23.16
  Top 0.2: 36.61,26.48 37.39,25.71
  Top 0.254: 41.6,4.8 41.6,5.3 I2C.1 | 45.38,4.44 45.38,6.49 44.35,7.5 44.36,9.68 44.64,9.94 44.64,10.91
  Top 0.305: 41.6,4.8 41.61,4.2 41.61,4.19 42.12,3.67 44.6,3.67 45.38,4.44 | 39.15,16.37 44.64,10.91 | 37.39,23.16 39.14,21.41 | 36.61,26.48 35.76,26.48 35.01,27.23 35.01,28.27 33.93,29.33 13.06,29.33 12.12,28.39 | 10.9,25.77 U$2.3
  Top 0.406: 39.14,21.41 39.15,16.37 | 12.12,28.39 12.12,27 10.9,25.77
N$25  (via drill 0.3)
  Top 0.254: 42.69,5.9 42.58,5.4 I2C.2
  Top 0.305: 40.75,3.27 40.23,2.76 39.16,2.76 | 13.4,25.1 U$2.5
  Top 0.406: 42.69,5.9 41.98,6.65 41.12,6.65 40.75,6.28 40.75,3.27 | v38.58,2.19 39.16,2.76 | 13.4,25.1 13.45,25.1
  Top 0.61: 13.45,25.1 13.44,24.24 12.02,22.82 v8.94,22.81
  Bottom 0.2: 26.59,2.19 25.45,1.04 8.14,1.04 7.79,1.45
  Bottom 0.305: 26.59,2.19 v38.58,2.19
  Bottom 0.406: v8.94,22.81 7.8,21.69 7.79,2.56 7.79,1.45
N$27  (via drill 0.3)
  Top 0.2: 44.84,19.9 44.83,23.28 45.35,23.8 45.35,27.02 v45.17,27.21
  Top 0.254: 44.44,5.4 I2C.4 | 46.86,19.75 45.02,19.75 44.84,19.9
  Top 0.305: 44.44,5.4 v44.38,6.54 | v45.76,9.86 46.94,9.86 48.64,11.56 48.66,17.91 46.86,19.75
  Bottom 0.254: 45.42,8.5 C3.2 45.76,8.57 | 28.5,25.55 U$2.17
  Bottom 0.305: 45.42,8.5 45.42,7.55 v44.38,6.54 | v45.76,9.86 45.76,8.57 | v45.17,27.21 45.18,28.4 44.26,29.32 30.76,29.32 29.91,28.46 29.91,26.96 28.5,25.55
N$29
  Top 0.254: 59.69,18.99 CN2.2 | 54.1,22.6 U$2.RUN
  Top 0.305: 59.69,18.99 57.29,18.99 57.1,18.81 56.1,18.81 55.41,19.5 55.41,21.29
  Top 0.406: 54.1,22.6 55.41,21.29
N$33
  Bottom 0.127: 58.61,8.47 58.48,8.46 IC1.26 | 60.7,20.3 C10.1 | 61.66,17.99 C11.1
  Bottom 0.254: 58.61,8.47 60.3,8.47 60.3,10.9 61.27,10.89 61.5,11.1 61.5,12.55 62.31,13.36 62.98,13.36 63.31,13.7 63.31,17.19 62.64,17.86 61.81,17.86 61.66,17.99
  Bottom 0.305: 61.66,17.99 60.91,18.74 60.91,20.09 60.7,20.3
N$34  (via drill 0.3)
  Top 0.254: v63.21,19.18 63.24,19.29 63.24,19.27 61.86,17.9 61.86,16.74 61.38,16.23 60.3,16.21 57.12,16.24 R8.1
  Bottom 0.127: 62.5,20.3 C10.2
  Bottom 0.305: v63.21,19.18 62.5,20.3
N$35
  Bottom 0.254: 59.99,17.64 59.99,16.12 60.44,16.12 61.09,15.49 61.09,11.77 60.81,11.51 60.26,11.51 59.88,11.14 59.88,9.96 59.11,9.21 58.16,9.21 IC1.25
  Bottom 0.406: C11.2 59.99,17.64
N$41
  Bottom 0.127: 40.62,17.31 IC3.5
  Bottom 0.254: 40.62,17.31 40.62,18.79 41.55,19.69 C24.2
N$42
  Bottom 0.127: 38.7,17.77 38.69,17.27 IC3.2
  Bottom 0.254: 37.06,19.41 38.7,17.77
  Bottom 0.406: 37.06,19.41 37.06,20.64 38.02,21.6 C25.1
N$43
  Bottom 0.127: 39.98,17.3 IC3.4
  Bottom 0.254: 39.98,17.3 39.98,18.61 39.06,19.54 C25.2
N$44  (via drill 0.3)
  Top 0.254: v50.79,4.46 50.76,4.14 | 51.29,17.8 51.38,17.8 C27.1
  Top 0.305: 50.76,4.14 v50.77,2.73 | 51.29,17.8 v51.29,16.68
  Top 0.406: v39.2,10.5 40.12,9.55 40.11,4.74 39.6,4.26 v39.6,3.58
  Bottom 0.254: v39.2,10.5 39.3,10.63 IC3.18 | 41.47,3.58 43.36,1.69 49.75,1.69 v50.77,2.73 | v50.79,4.46 51.61,5.3 53.44,5.3 54.98,6.84 54.99,10.49 54.65,10.82 54.66,14.38 52.36,16.68 v51.29,16.68
  Bottom 0.305: 41.47,3.58 v39.6,3.58
N$45
  Bottom 0.127: 41.94,16.7 41.94,17.19 IC3.7
  Bottom 0.254: 41.94,16.7 42.25,16.39 42.25,15.88 40.65,14.24 | 31.75,17.3 R11.2
  Bottom 0.305: 40.65,14.24 38.45,14.24 36.88,12.66 32.38,12.66 31.75,13.28 31.75,17.3
N$46
  Bottom 0.127: 41.27,11.4 IC3.15
  Bottom 0.254: 41.25,10.61 41.27,11.4 | 36.98,6.34 R13.1
  Bottom 0.305: 36.98,6.34 41.25,10.61
N$47
  Bottom 0.127: 41.3,17.24 IC3.6
  Bottom 0.254: 41.3,17.24 41.27,18.32 41.88,18.94 42.27,18.94 42.73,19.4 42.73,20.96 43.77,22.04 43.88,22.14 44.5,22.14 R10.2
N$49
  Bottom 0.127: 41.9,11.4 IC3.14
  Bottom 0.254: 41.9,11.4 41.9,8.7 40,6.8 R14.1
N$50
  Bottom 0.127: 42.56,11.4 IC3.13 | 43.1,6.7 R15.1
  Bottom 0.254: 42.56,11.4 42.56,7.2 43.1,6.7
N$51
  Bottom 0.127: 43.9,11.4 IC3.11 | 48.2,5.05 R16.1
  Bottom 0.254: 44.09,11.24 43.9,11.4 | 48.2,5.05 47.3,5.95
  Bottom 0.305: 44.09,11.24 46.07,11.24 47.5,9.79 47.51,7.77 47.52,7.59 46.94,7.03 46.94,6.3 47.3,5.95
N$52
  Bottom 0.127: 39.96,11.47 IC3.17 | 33.59,6.7 R12.1
  Bottom 0.254: 39.96,10.26 39.96,11.47
  Bottom 0.305: 39.96,10.26 37.1,7.41 34.62,7.41 33.91,6.7
  Bottom 0.406: 33.59,6.7 33.91,6.7
OSD_IN  (via drill 0.3)
  Top 0.254: 55.2,5.3 CAM.3
  Top 0.305: v55.2,1.95 55.2,5.3
  Bottom 0.127: 56.58,1.95 C9.2 | 52.8,1.95 R9.2
  Bottom 0.254: v55.2,1.95 56.58,1.95
  Bottom 0.305: 52.8,1.95 v55.2,1.95
SCLK  (via drill 0.3)
  Top 0.127: v40.04,25.8 40.06,25.89
  Top 0.2: 57.91,27.99 56.52,29.38 41.19,29.39 40.06,28.26
  Top 0.254: v53.42,13 52.81,13 52.34,13.5 52.34,16.07 52.67,16.41 54.06,16.41 55.3,17.65 58.52,17.65 58.76,17.41 60.58,17.41 60.99,17.81 60.99,20.15 61.4,20.57 61.4,22.2 60.54,23.09 58.94,23.09 57.91,24.13 57.91,27.99
  Top 0.305: 40.06,25.89 40.06,28.26
  Bottom 0.127: 52.42,13 IC1.10 | 36.3,25.2 U$2.23
  Bottom 0.18: 40.08,25.8 39.65,26.24 37.33,26.24 36.3,25.2
  Bottom 0.254: v53.42,13 52.42,13
  Bottom 0.305: 40.08,25.8 v40.04,25.8
SDIN  (via drill 0.3)
  Top 0.127: 32.38,23.39 v32.38,23.48
  Top 0.305: 32.38,23.39 31.24,24.54 U$2.19
  Bottom 0.127: 51.67,12.36 52.3,12.36 IC1.9
  Bottom 0.254: 51.67,12.36 50.9,13.13 50.9,14.26 49.92,15.24 47,15.24 | 46.54,15.7 46.54,22.75 45.97,23.32 32.54,23.31 v32.38,23.48
  Bottom 0.305: 46.54,15.7 47,15.24
SDOUT  (via drill 0.3)
  Top 0.254: 43.3,11.07 v43.94,10.43 | 33.8,25 U$2.21
  Top 0.406: 43.3,11.07 38.34,16.04 38.31,21.3 34.69,24.96 33.8,25
  Bottom 0.127: 52.4,13.7 IC1.11
  Bottom 0.254: 52.4,13.7 53.71,13.66 54.21,13.16 54.21,9.86 54.53,9.55 54.52,6.97 53.24,5.7 51.04,5.69 50.08,4.74 50.08,4 48.83,2.74 45.8,2.74 45.1,3.45
  Bottom 0.305: 45.1,3.45 45.1,6.03 46.79,7.72 46.79,9.81 46.05,10.56 44.09,10.56 v43.94,10.43
V_OUT
  Top 0.254: U$1.RING1 58.55,8.4 58.54,11.19 58.96,11.61 59.62,11.6 CN3.2 59.7,11.6 60.3,11.6 60.95,12.1 60.95,14.16 60.38,14.55 57.08,14.55 R8.2
VDA33
  Bottom 0.127: 38,17.5 IC3.1 | 35,22.2 C23.1 | 30.5,7.3 C29.1 | 42.58,16.7 IC3.8 | C8.1 32.6,22.2 32.61,22.2 | 32.5,22.1 32.3,22.1 32.14,22.05 | 34.89,9.61 35,9.5 35.3,9.5 IC4.2 35.4,9.7 35.51,9.59
  Bottom 0.254: 36.39,19.15 38,17.5 | 35.1,22.1 C23.1 | 30.5,10.4 C28.1 30.3,10.4 | 42.88,15.57 42.88,16.39 42.58,16.7 | 32.14,22.05 32.25,22.1 | 32.5,22.1 C8.1
  Bottom 0.305: 30.5,10.4 30.5,8.8 | 30.5,8.8 30.5,7.3 | 42.88,15.57 42.51,15.2 41.09,13.78 38.83,13.78 37.19,12.14 | 30.5,8.8 34.1,8.8 34.89,9.61 34.94,9.65
  Bottom 0.406: 36.39,19.15 36.39,20.85 35.1,22.1 | 35,22.2 32.61,22.2 | 35.44,9.51 35.51,9.59 37.17,11.22 37.19,12.14 | 32.14,22.05 31.51,21.44 31.51,20.93 29.91,19.32 29.91,10.7 30.3,10.4
VDD33  (via drill 0.3)
  Top 0.254: v51.39,22.73 50.09,21.43 49.8,21.3 C26.1 | v54.4,17.77 54.41,17.37 53.83,16.81 52.4,16.82 51.9,16.32 51.92,11.51 v53.5,9.9
  Top 0.406: v34,8.05 34,7.72 33.99,6.83 33.99,5.19 v34.36,4.49 | v45.98,3.5 45.52,3.5 44.71,2.69 v41.36,2.7
  Bottom 0.127: 38,11.4 IC3.20 | 8.38,25.12 8.3,25.1 U$2.1 | 46.4,4.9 46.44,4.47 R16.2 46.4,4.9
  Bottom 0.2: 38.38,0.69 7.71,0.69
  Bottom 0.254: 53.7,17.76 51.88,19.59 | v53.5,9.9 54.06,9.32 54.07,7.12 53.06,6.09 50.45,6.1 49.54,5.19 49.55,4.19 48.8,3.42 47.48,3.42 46.44,4.47 v45.98,3.5 | 38.01,9.51 38,11.4 | 33.57,4.47 33.56,4.71 R12.2 | 7.71,0.69 7.04,1.38
  Bottom 0.305: v51.39,22.73 51.4,21.54 51.88,21.06 51.88,19.59 | v54.4,17.77 53.7,17.76 | 38.01,9.51 36.55,8.05 v34,8.05 | 38.38,0.69 39.3,1.62 39.3,2.7 | 39.3,2.7 38.74,3.26 35.59,3.26 v34.36,4.49 | 39.3,2.7 v41.36,2.7
  Bottom 0.406: 33.57,4.47 v34.36,4.49 | 8.38,25.12 7.04,23.8 7.04,1.38

### Text on the board
bPlace: telecoder β Apr,2017